# EAGLE design WILD64_HDI (EAGLE 9.6.2)
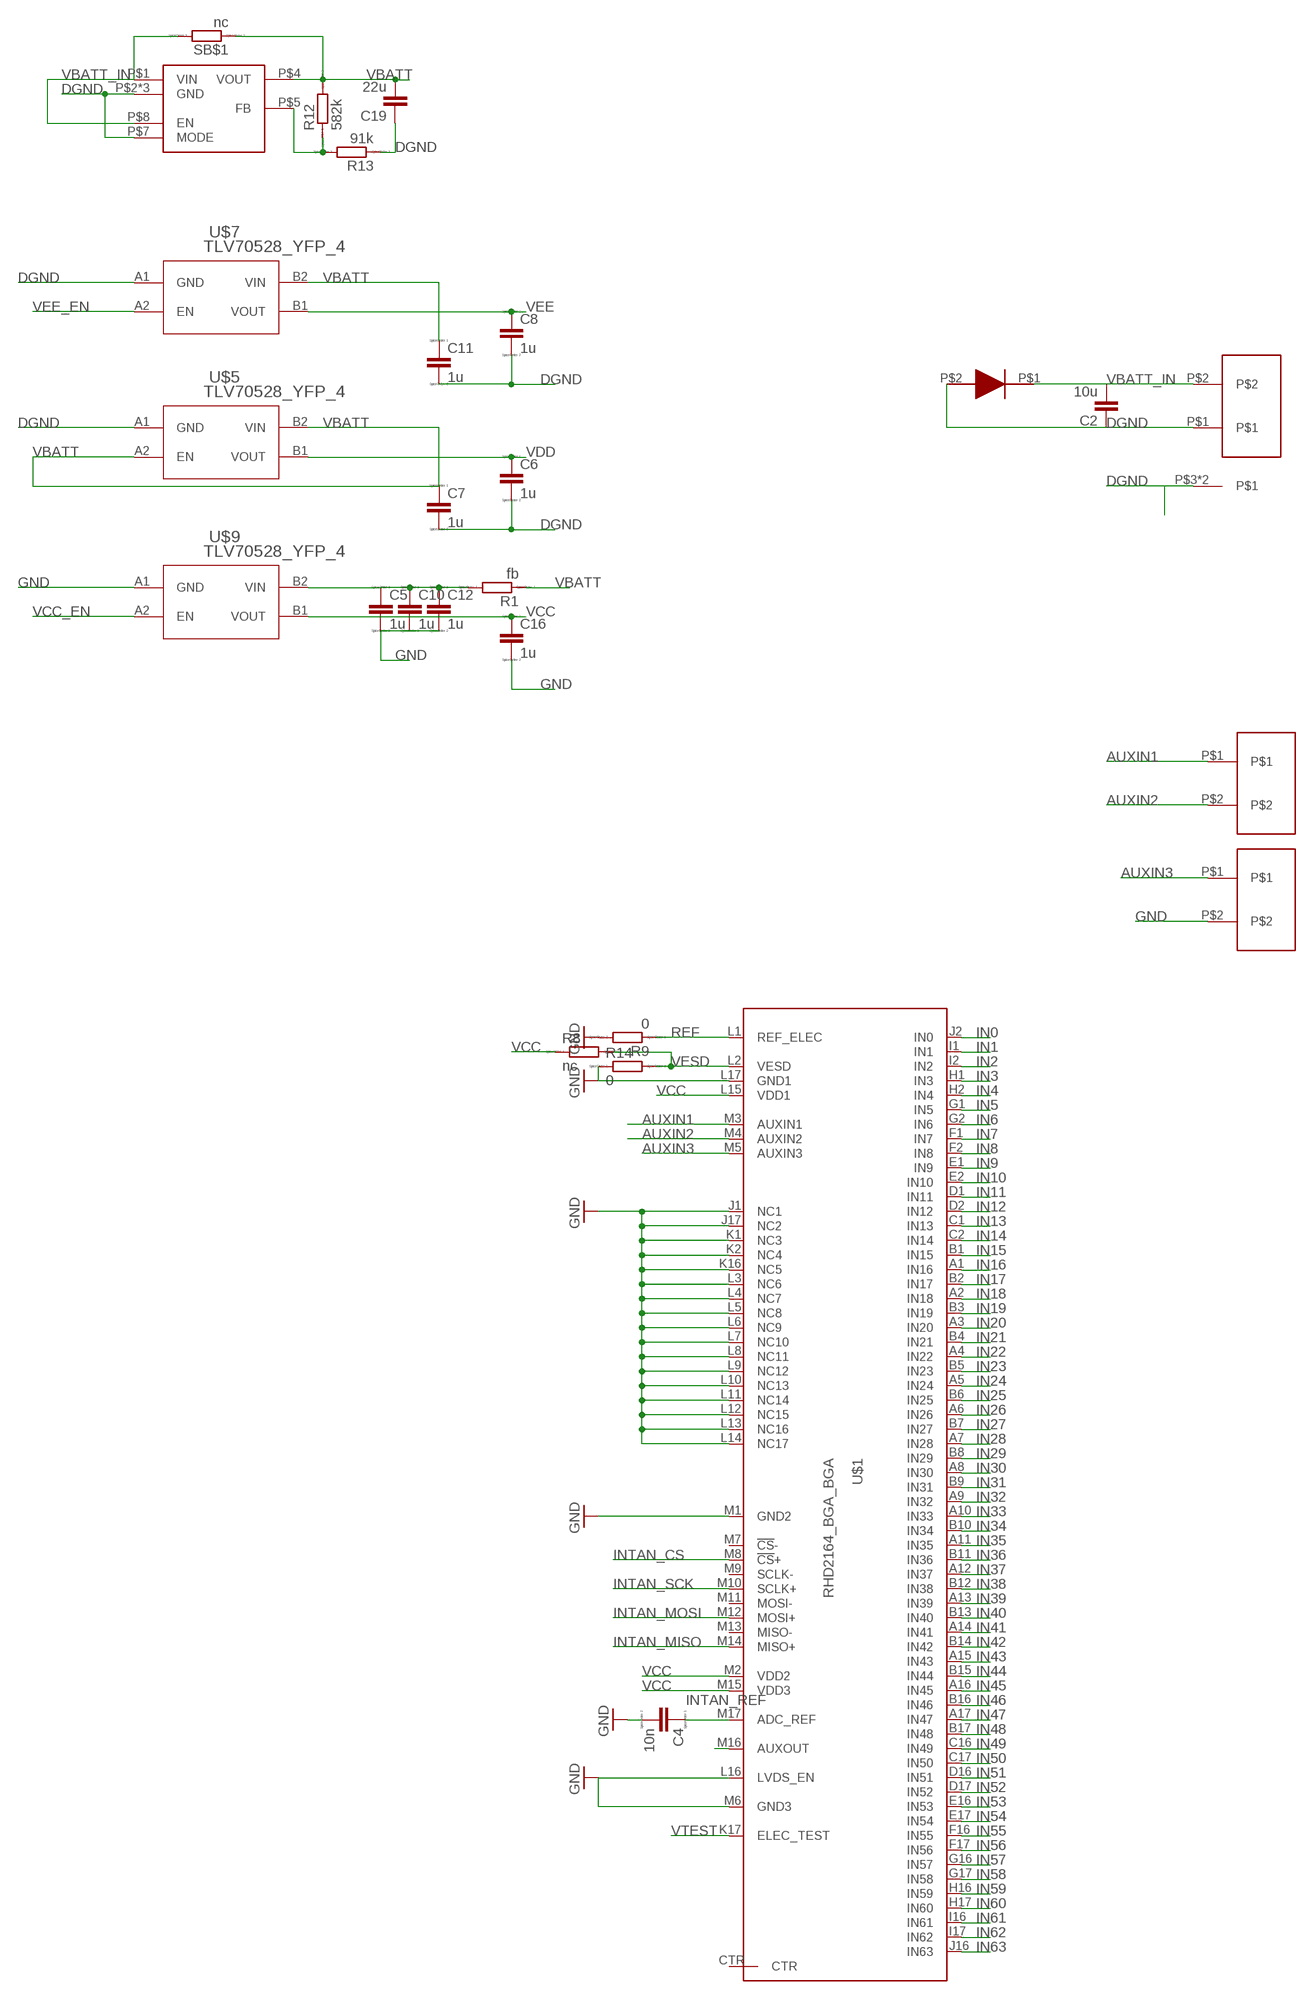
[diagram p0: schematic, sheet 1, part 1 of 2]
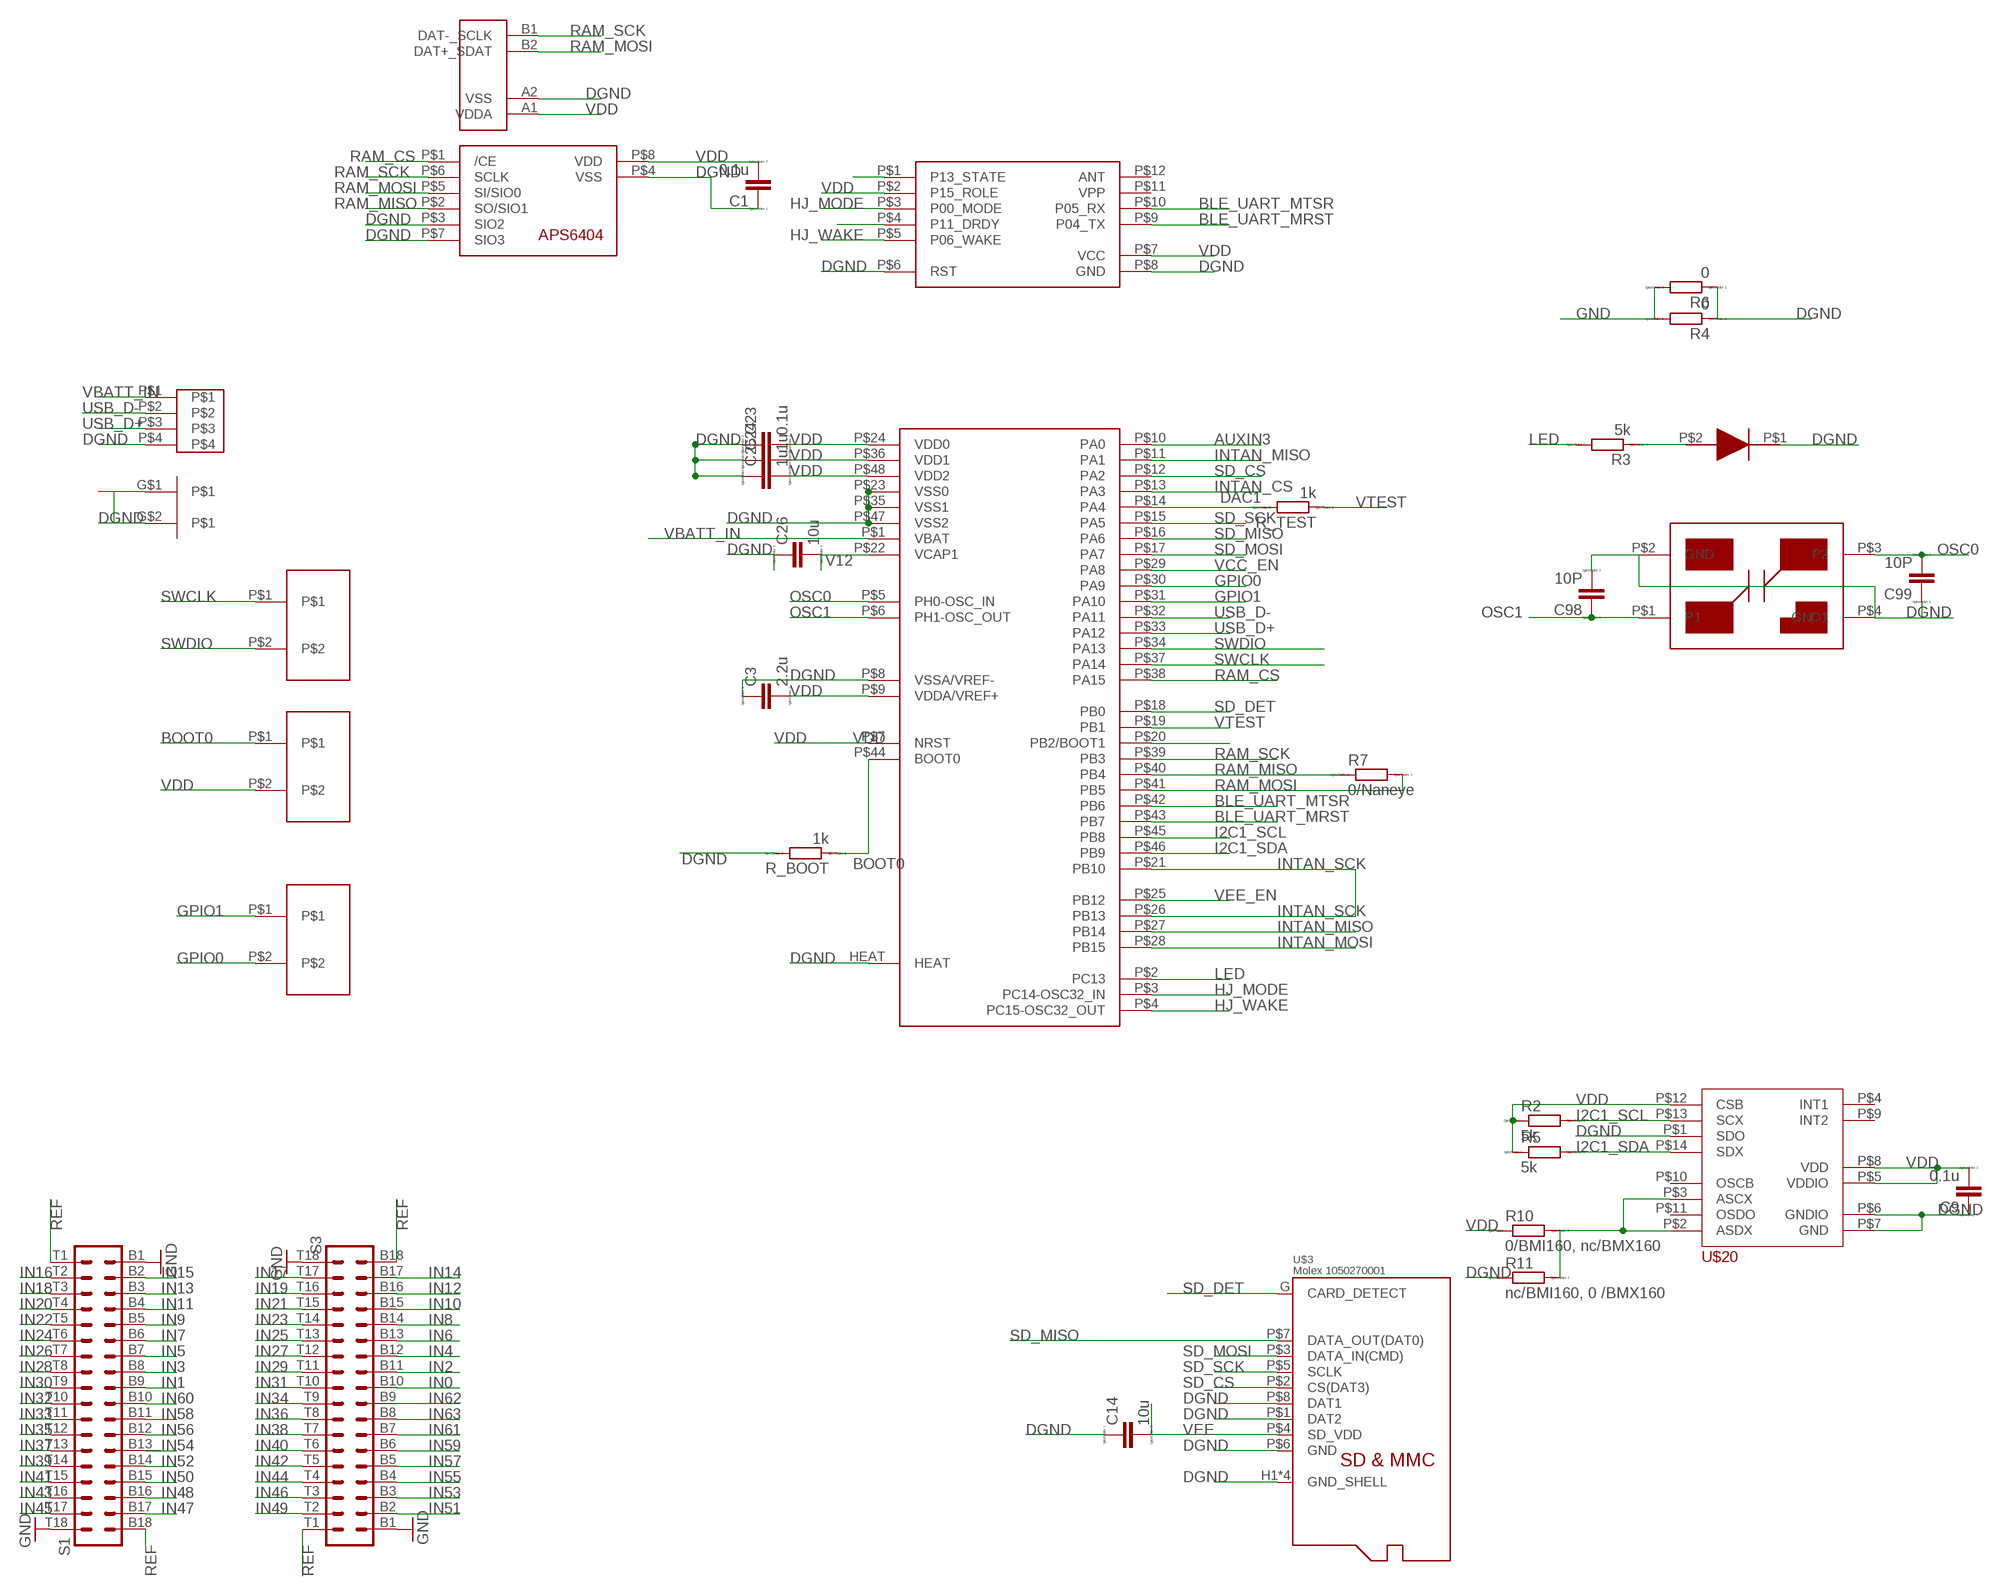
[diagram p1: schematic, sheet 1, part 2 of 2]

## Parts
C1  0.1u  CC0201  [C0201]
C2  10u  C_0402  [0402]
C3  2.2u  CC0201  [C0201]
C4  10n  CC0201  [C0201]
C5  1u  CC0201  [C0201]
C6  1u  CC0201  [C0201]
C7  1u  CC0201  [C0201]
C8  1u  CC0201  [C0201]
C9  0.1u  CC0201  [C0201]
C10  1u  CC0201  [C0201]
C11  1u  CC0201  [C0201]
C12  1u  CC0201  [C0201]
C14  10u  CC0402  [C0402]
C16  1u  CC0201  [C0201]
C19  22u  C_0402  [0402]
C23  0.1u  CC0201  [C0201]
C24  1u  CC0201  [C0201]
C25  1u  CC0201  [C0201]
C26  10u  CC0402  [C0402]
C98  10P  CC0201  [C0201]
C99  10P  CC0201  [C0201]
R1  fb  RR0201  [R0201]
R2  5k  RR0201  [R0201]
R3  5k  RR0201  [R0201]
R4  0  RR0201  [R0201]
R5  5k  RR0201  [R0201]
R6  0  RR0201  [R0201]
R7  0/Naneye  RR0201  [R0201]
R8  nc  RR0201  [R0201]
R9  0  RR0402  [R0402]
R10  0/BMI160, nc/BMX160  RR0201  [R0201]
R11  nc/BMI160, 0 /BMX160  RR0201  [R0201]
R12  582k  RR0201  [R0201]
R13  91k  RR0201  [R0201]
R14  0  RR0201  [R0201]
R_BOOT  1k  RR0201  [R0201]
R_TEST  1k  RR0201  [R0201]
S1  OMNETICS_A79025  [OMNETICS_A79025]
S3  OMNETICS_A79025  [OMNETICS_A79025]
SB$1  nc  RR0201  [R0201]
U$1  RHD2164_BGA_BGA  [BGA104_9X7]
U$2  1.0MM_1X2VIA  [PIN_1.0MM_1X2]
U$3  Molex 1050270001  MICROSD_SHORT_1.7H  [MICROSD_SHORT_1.7H]
U$4  NANEYECBGA  [NANEYEC_4BGA]
U$5  TLV70528_YFP_4  [YFP4]
U$6  STM32F411_QFN48  [UFQFPN48]
U$7  TLV70528_YFP_4  [YFP4]
U$8  1.27MM_1X2CONN  [1.27MM_1X2]
U$9  TLV70528_YFP_4  [YFP4]
U$10  HJ580  [HJ580]
U$11  DIODE0402  [0402_LED]
U$12  1.0MM_1X4PAD  [1.0MM_CONN_1X4_SMD]
U$13  1.00MM_1X2PAD  [1.0MM_CONN_1X2_SMD]
U$14  APS6404  [USON-8L_3X2]
U$15  ABM12_CRYSTAL  [SMD4_1.6MMX1.2MM]
U$16  DIODE0402  [0402_LED]
U$17  1.27MM_1X2CONN  [1.27MM_1X2]
U$18  1.27MM_1X2CONN  [1.27MM_1X2]
U$19  1.27MM_1X2CONN  [1.27MM_1X2]
U$20  BMI27014  [14_VFLGA]
U$22  TPSM83100  [MICROSIP_SIU0008A]

## Nets
AUXIN1: U$1.M3(AUXIN1) U$19.P$1
AUXIN2: U$1.M4(AUXIN2) U$19.P$2
AUXIN3: U$1.M5(AUXIN3) U$6.P$10(PA0) U$18.P$1
AUXOUT: U$1.M16(AUXOUT)
BLE_UART_MRST: U$6.P$43(PB7) U$10.P$9(P04_TX)
BLE_UART_MTSR: U$6.P$42(PB6) U$10.P$10(P05_RX)
BOOT0: R_BOOT.1 U$6.P$44(BOOT0) U$8.P$1
DAC1: R_TEST.2 U$6.P$14(PA4)
DGND: C1.1 C2.1 C3.1 C6.2 C7.2 C8.2 C9.1 C11.2 C14.1 C19.1 C23.1 C24.1 C25.1 C26.1 C98.2 C99.1 R4.1 R6.1 R11.1 R13.1 R_BOOT.2 U$3.H1(GND_SHELL) U$3.H2(GND_SHELL) U$3.H3(GND_SHELL) U$3.H4(GND_SHELL) U$3.P$1(DAT2) U$3.P$6(GND) U$3.P$8(DAT1) U$4.A2(VSS) U$5.A1(GND) U$6.HEAT U$6.P$8(VSSA/VREF-) U$6.P$23(VSS0) U$6.P$35(VSS1) U$6.P$47(VSS2) U$7.A1(GND) U$10.P$6(RST) U$10.P$8(GND) U$11.P$2(IN) U$12.G$1 U$12.G$2 U$12.P$4 U$13.P$1 U$13.P$3 U$13.P$4 U$14.P$3(SIO2) U$14.P$4(VSS) U$14.P$7(SIO3) U$15.P$2(GND) U$15.P$4(GND1) U$16.P$1(OUT) U$20.P$1(SDO) U$20.P$6(GNDIO) U$20.P$7(GND) U$22.P$2(GND) U$22.P$3(GND) U$22.P$6(GND) U$22.P$7(MODE)
GND [thick]: C4.2 C5.2 C10.2 C12.2 C16.2 R4.2 R6.2 R9.2 R14.1 S1.B1 S1.T18 S3.B1 S3.T18 U$1.J1(NC1) U$1.J17(NC2) U$1.K1(NC3) U$1.K2(NC4) U$1.K16(NC5) U$1.L3(NC6) U$1.L4(NC7) U$1.L5(NC8) U$1.L6(NC9) U$1.L7(NC10) U$1.L8(NC11) U$1.L9(NC12) U$1.L10(NC13) U$1.L11(NC14) U$1.L12(NC15) U$1.L13(NC16) U$1.L14(NC17) U$1.L16(LVDS_EN) U$1.L17(GND1) U$1.M1(GND2) U$1.M6(GND3) U$9.A1(GND) U$18.P$2
GPIO0: U$6.P$30(PA9) U$17.P$2
GPIO1: U$6.P$31(PA10) U$17.P$1
HJ_MODE: U$6.P$3(PC14-OSC32_IN) U$10.P$3(P00_MODE)
HJ_WAKE: U$6.P$4(PC15-OSC32_OUT) U$10.P$5(P06_WAKE)
I2C1_SCL: R2.2 U$6.P$45(PB8) U$20.P$13(SCX)
I2C1_SDA: R5.2 U$6.P$46(PB9) U$20.P$14(SDX)
IN0: S3.B10 U$1.J2(IN0)
IN1: S1.B9 U$1.I1(IN1)
IN2: S3.B11 U$1.I2(IN2)
IN3: S1.B8 U$1.H1(IN3)
IN4: S3.B12 U$1.H2(IN4)
IN5: S1.B7 U$1.G1(IN5)
IN6: S3.B13 U$1.G2(IN6)
IN7: S1.B6 U$1.F1(IN7)
IN8: S3.B14 U$1.F2(IN8)
IN9: S1.B5 U$1.E1(IN9)
IN10: S3.B15 U$1.E2(IN10)
IN11: S1.B4 U$1.D1(IN11)
IN12: S3.B16 U$1.D2(IN12)
IN13: S1.B3 U$1.C1(IN13)
IN14: S3.B17 U$1.C2(IN14)
IN15: S1.B2 U$1.B1(IN15)
IN16: S1.T2 U$1.A1(IN16)
IN17: S3.T17 U$1.B2(IN17)
IN18: S1.T3 U$1.A2(IN18)
IN19: S3.T16 U$1.B3(IN19)
IN20: S1.T4 U$1.A3(IN20)
IN21: S3.T15 U$1.B4(IN21)
IN22: S1.T5 U$1.A4(IN22)
IN23: S3.T14 U$1.B5(IN23)
IN24: S1.T6 U$1.A5(IN24)
IN25: S3.T13 U$1.B6(IN25)
IN26: S1.T7 U$1.A6(IN26)
IN27: S3.T12 U$1.B7(IN27)
IN28: S1.T8 U$1.A7(IN28)
IN29: S3.T11 U$1.B8(IN29)
IN30: S1.T9 U$1.A8(IN30)
IN31: S3.T10 U$1.B9(IN31)
IN32: S1.T10 U$1.A9(IN32)
IN33: S1.T11 U$1.A10(IN33)
IN34: S3.T9 U$1.B10(IN34)
IN35: S1.T12 U$1.A11(IN35)
IN36: S3.T8 U$1.B11(IN36)
IN37: S1.T13 U$1.A12(IN37)
IN38: S3.T7 U$1.B12(IN38)
IN39: S1.T14 U$1.A13(IN39)
IN40: S3.T6 U$1.B13(IN40)
IN41: S1.T15 U$1.A14(IN41)
IN42: S3.T5 U$1.B14(IN42)
IN43: S1.T16 U$1.A15(IN43)
IN44: S3.T4 U$1.B15(IN44)
IN45: S1.T17 U$1.A16(IN45)
IN46: S3.T3 U$1.B16(IN46)
IN47: S1.B17 U$1.A17(IN47)
IN48: S1.B16 U$1.B17(IN48)
IN49: S3.T2 U$1.C16(IN49)
IN50: S1.B15 U$1.C17(IN50)
IN51: S3.B2 U$1.D16(IN51)
IN52: S1.B14 U$1.D17(IN52)
IN53: S3.B3 U$1.E16(IN53)
IN54: S1.B13 U$1.E17(IN54)
IN55: S3.B4 U$1.F16(IN55)
IN56: S1.B12 U$1.F17(IN56)
IN57: S3.B5 U$1.G16(IN57)
IN58: S1.B11 U$1.G17(IN58)
IN59: S3.B6 U$1.H16(IN59)
IN60: S1.B10 U$1.H17(IN60)
IN61: S3.B7 U$1.I16(IN61)
IN62: S3.B9 U$1.I17(IN62)
IN63: S3.B8 U$1.J16(IN63)
INTAN_CS: U$1.M8(!CS!+) U$6.P$13(PA3)
INTAN_MISO: U$1.M14(MISO+) U$6.P$11(PA1) U$6.P$27(PB14)
INTAN_MOSI: U$1.M12(MOSI+) U$6.P$28(PB15)
INTAN_REF: C4.1 U$1.M17(ADC_REF)
INTAN_SCK: U$1.M10(SCLK+) U$6.P$21(PB10) U$6.P$26(PB13)
LED: R3.2 U$6.P$2(PC13)
N$1: R10.2 R11.2 U$20.P$2(ASDX) U$20.P$3(ASCX)
N$7: R12.1 R13.2 U$22.P$5(FB)
N$11: R3.1 U$16.P$2(IN)
N$16: U$10.P$4(P11_DRDY)
N$21: U$10.P$1(P13_STATE)
N$27: U$6.P$20(PB2/BOOT1)
OSC0: C99.2 U$6.P$5(PH0-OSC_IN) U$15.P$3(P2)
OSC1: C98.1 U$6.P$6(PH1-OSC_OUT) U$15.P$1(P1)
RAM_CS: U$6.P$38(PA15) U$14.P$1(/CE)
RAM_MISO: R7.1 U$6.P$40(PB4) U$14.P$2(SO/SIO1)
RAM_MOSI: R7.2 U$4.B2(DAT+_SDAT) U$6.P$41(PB5) U$14.P$5(SI/SIO0)
RAM_SCK: U$4.B1(DAT-_SCLK) U$6.P$39(PB3) U$14.P$6(SCLK)
REF [thick]: R9.1 S1.B18 S1.T1 S3.B18 S3.T1 U$1.L1(REF_ELEC)
SD_CS: U$3.P$2(CS(DAT3)) U$6.P$12(PA2)
SD_DET: U$3.G(CARD_DETECT) U$6.P$18(PB0)
SD_MISO: U$3.P$7(DATA_OUT(DAT0)) U$6.P$16(PA6)
SD_MOSI: U$3.P$3(DATA_IN(CMD)) U$6.P$17(PA7)
SD_SCK: U$3.P$5(SCLK) U$6.P$15(PA5)
SWCLK: U$2.P$1 U$6.P$37(PA14)
SWDIO: U$2.P$2 U$6.P$34(PA13)
USB_D+: U$6.P$33(PA12) U$12.P$3
USB_D-: U$6.P$32(PA11) U$12.P$2
V12: C26.2 U$6.P$22(VCAP1)
VBATT: C7.1 C11.1 C19.2 R1.1 R12.2 SB$1.1 U$5.A2(EN) U$5.B2(VIN) U$7.B2(VIN) U$22.P$4(VOUT)
VBATT_IN: C2.2 SB$1.2 U$6.P$1(VBAT) U$11.P$1(OUT) U$12.P$1 U$13.P$2 U$22.P$1(VIN) U$22.P$8(EN)
VCC: C16.1 R8.1 U$1.L15(VDD1) U$1.M2(VDD2) U$1.M15(VDD3) U$9.B1(VOUT)
VCC_EN: U$6.P$29(PA8) U$9.A2(EN)
VCC_LPF: C5.1 C10.1 C12.1 R1.2 U$9.B2(VIN)
VDD: C1.2 C3.2 C6.1 C9.2 C23.2 C24.2 C25.2 R2.1 R5.1 R10.1 U$4.A1(VDDA) U$5.B1(VOUT) U$6.P$7(NRST) U$6.P$9(VDDA/VREF+) U$6.P$24(VDD0) U$6.P$36(VDD1) U$6.P$48(VDD2) U$8.P$2 U$10.P$2(P15_ROLE) U$10.P$7(VCC) U$14.P$8(VDD) U$20.P$5(VDDIO) U$20.P$8(VDD) U$20.P$12(CSB)
VEE: C8.1 C14.2 U$3.P$4(SD_VDD) U$7.B1(VOUT)
VEE_EN: U$6.P$25(PB12) U$7.A2(EN)
VESD [thick]: R8.2 R14.2 U$1.L2(VESD)
VTEST: R_TEST.1 U$1.K17(ELEC_TEST) U$6.P$19(PB1)
Unconnected: U$1.CTR U$1.M7(!CS!-) U$1.M9(SCLK-) U$1.M11(MOSI-) U$1.M13(MISO-) U$10.P$11(VPP) U$10.P$12(ANT) U$20.P$4(INT1) U$20.P$9(INT2) U$20.P$10(OSCB) U$20.P$11(OSDO)

## Library data of the parts
C1 C3-C12 C14 C16 C23-C26 C98 C99 = eagle-ltspice:C: CAPACITOR, European symbol; SPICEMODEL: NONE; SPICEPREFIX: C
C2 C19 = INTAN_largeBGA:C: Capacitor
R1-R14 R_BOOT R_TEST SB$1 = eagle-ltspice:R: RESISTOR, European symbol; SPICEMODEL: NONE; SPICEPREFIX: R
S1 S3 = intan:OMNETICS_A79025: Omnetics A79025 36-pin connector
U$1 = INTAN_largeBGA:RHD2164_BGA: Intan Technologies RHD2164 chip, BGA package (9x7mm 104-pin)
U$2 = HD128:1.0MM_1X2VIA
U$3 = HD128:MICROSD_SHORT_1.7H
U$4 = HD128:NANEYEC
U$5 U$7 U$9 = TLV7025:TLV70528_YFP_4; DATASHEETURL: http://www.ti.com/lit/gpn/TLV70528; DESCRIPTION: 200-mA, Low IQ, Low-Noise, Low-Dropout Regulator in Ultra-Small 0.8-mm x 0.8-mm WCSP; FAMILY_NAME: SINGLE CHANNEL LDO; GENERIC_PART_NUMBER: TLV70528; INDUSTRY_STD_PKG_TYPE: DSBGA; MANUFACTURER: Texas Instruments; MANUFACTURER_PART_NUMBER: tlv70528_yfp_4; PACKAGE_DESIGNATOR: YFP; PIN_COUNT: 4; VENDOR: Texas Instruments
U$6 = HD128:STM32F411_QFN48
U$8 U$17-U$19 = HD128:1.27MM_1X2CONN
U$10 = HD128:HJ580
U$11 U$16 = HD128:DIODE
U$12 = HD128:1.0MM_1X4PAD
U$13 = HD128:1.00MM_1X2PAD
U$14 = HD128:APS6404
U$15 = HD128:ABM12_CRYSTAL
U$20 = HD128:BMI270
U$22 = HD128:TPSM83100

## Net classes
1 thick: width 0.102 mm

## Board
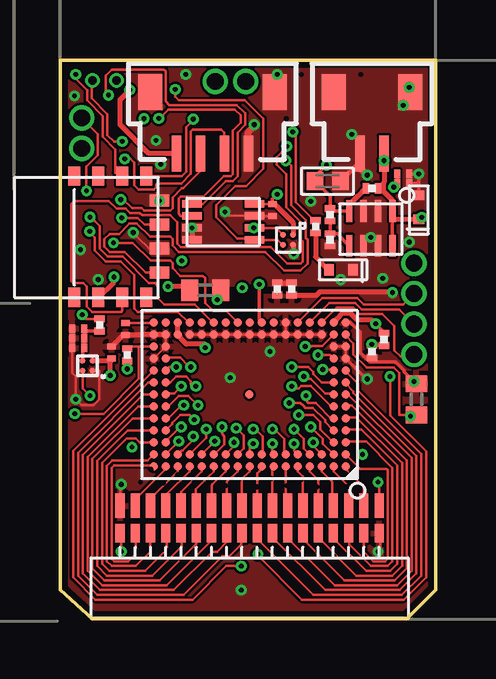
[diagram p2: board, top side]
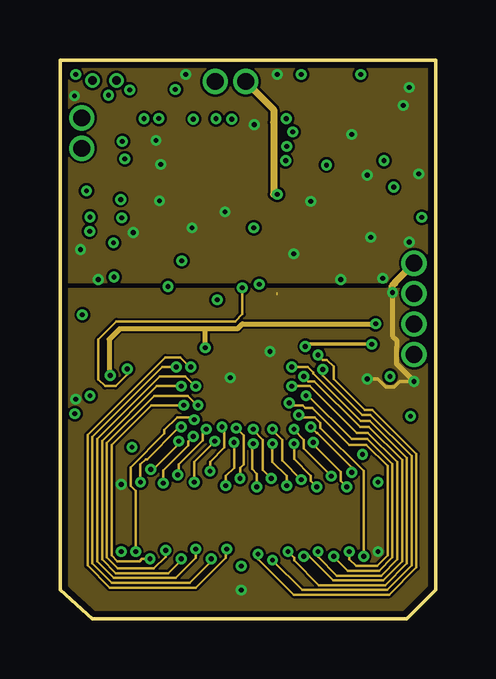
[diagram p3: board, inner layer Route2]
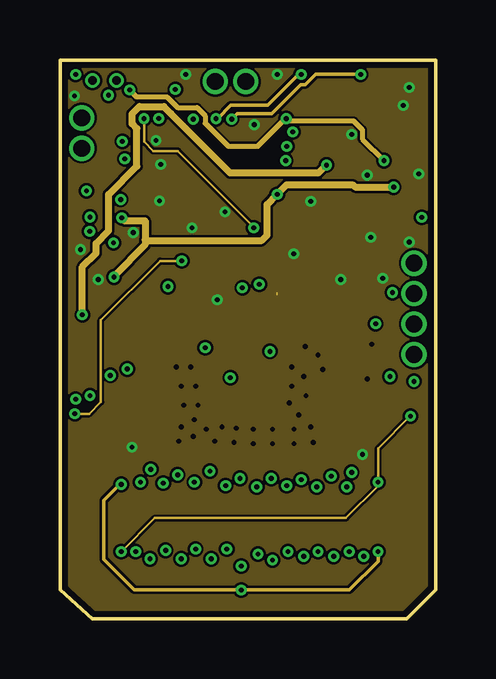
[diagram p4: board, inner layer Route15]
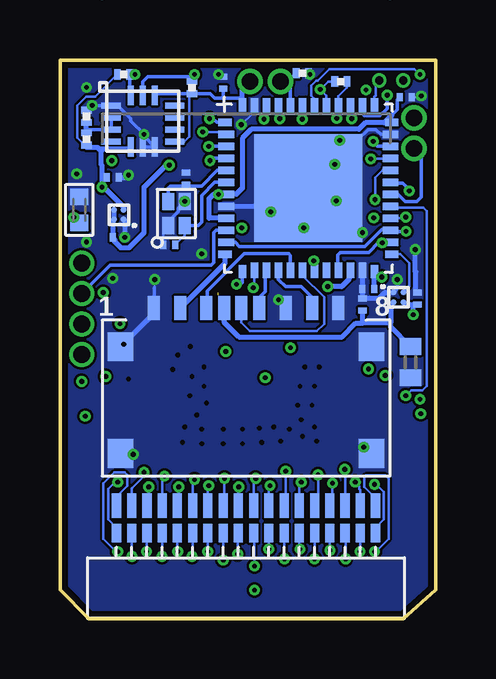
[diagram p5: board, bottom side, seen from below]

Size 15.65 x 23.3 mm. Coordinates in mm from the lower left corner, seen from the top.
Outline: 15.65,1.2 15.65,23.3 0,23.3 0,1.2 1.35,0 14.45,0 15.65,1.2
Copper layers ([2:[1+2*15+16:2]]): Top 0.012mm / dielectric 0.3mm / Route2 0.018mm / dielectric 0.34mm / Route15 0.018mm / dielectric 0.3mm / Bottom 0.012mm
Design rules "HQPCB_4layers_0.2mm_4mil *": minimum track width 0.1mm, minimum drill 0.2mm, track to track 0.1mm, track to pad 0.1mm, pad to pad 0.1mm, via to via 0.1mm, smd to smd 0mil, copper to edge 0.25mm, drill to drill 0.35mm, minimum pad ring 0.125mm, minimum via ring 0.125mm, stop-mask expansion 0mil, vias tented up to drill 0.3mm, thermal gap 0.2mm

### Footprints (pad centres in the part's own frame; a part is rotated, then mirrored left to right if it is on the bottom)
C0201 = smd 0.25 x 0.35: 1 -0.25,0; 2 0.25,0
0402 = smd 0.686 x 0.762: 1 -0.533,0; 2 0.533,0
C0402 = smd 0.7 x 0.9: 1 -0.65,0; 2 0.65,0
R0201 = smd 0.28 x 0.43: 1 -0.255,0; 2 0.255,0
R0402 = smd 0.7 x 0.9: 1 -0.65,0; 2 0.65,0
OMNETICS_A79025 = smd 0.381 x 0.762: B1 -5.397,-1.016; B2 -4.763,-1.016; B3 -4.128,-1.016; B4 -3.493,-1.016; B5 -2.857,-1.016; B6 -2.223,-1.016; B7 -1.587,-1.016; B8 -0.953,-1.016; B9 -0.318,-1.016; B10 0.318,-1.016; B11 0.953,-1.016; B12 1.587,-1.016; B13 2.223,-1.016; B14 2.857,-1.016; B15 3.493,-1.016; B16 4.128,-1.016; B17 4.763,-1.016; B18 5.397,-1.016 | smd 0.381 x 1.016: T1 -5.397,-2.159; T2 -4.763,-2.159; T3 -4.128,-2.159; T4 -3.493,-2.159; T5 -2.857,-2.159; T6 -2.223,-2.159; T7 -1.587,-2.159; T8 -0.953,-2.159; T9 -0.318,-2.159; T10 0.318,-2.159; T11 0.953,-2.159; T12 1.587,-2.159; T13 2.223,-2.159; T14 2.857,-2.159; T15 3.493,-2.159; T16 4.128,-2.159; T17 4.763,-2.159; T18 5.397,-2.159
BGA104_9X7 = smd 0.35 x 0.35: A1 -4,3; A2 -3.5,3; A3 -3,3; A4 -2.5,3; A5 -2,3; A6 -1.5,3; A7 -1,3; A8 -0.5,3; A9 0,3; A10 0.5,3; A11 1,3; A12 1.5,3; A13 2,3; A14 2.5,3; A15 3,3; A16 3.5,3; A17 4,3; B1 -4,2.5; B2 -3.5,2.5; B3 -3,2.5; B4 -2.5,2.5; B5 -2,2.5; B6 -1.5,2.5; B7 -1,2.5; B8 -0.5,2.5; B9 0,2.5; B10 0.5,2.5; B11 1,2.5; B12 1.5,2.5; B13 2,2.5; B14 2.5,2.5; B15 3,2.5; B16 3.5,2.5; B17 4,2.5; C1 -4,2; C2 -3.5,2; C16 3.5,2; C17 4,2; CTR 0.01,0; D1 -4,1.5; D2 -3.5,1.5; D16 3.5,1.5; D17 4,1.5; E1 -4,1; E2 -3.5,1; E16 3.5,1; E17 4,1; F1 -4,0.5; F2 -3.5,0.5; F16 3.5,0.5; F17 4,0.5; G1 -4,0; G2 -3.5,0; G16 3.5,0; G17 4,0; H1 -4,-0.5; H2 -3.5,-0.5; H16 3.5,-0.5; H17 4,-0.5; I1 -4,-1; I2 -3.5,-1; I16 3.5,-1; I17 4,-1; J1 -4,-1.5; J2 -3.5,-1.5; J16 3.5,-1.5; J17 4,-1.5; K1 -4,-2; K2 -3.5,-2; K16 3.5,-2; K17 4,-2; L1 -4,-2.5; L2 -3.5,-2.5; L3 -3,-2.5; L4 -2.5,-2.5; L5 -2,-2.5; L6 -1.5,-2.5; L7 -1,-2.5; L8 -0.5,-2.5; L9 0,-2.5; L10 0.5,-2.5; L11 1,-2.5; L12 1.5,-2.5; L13 2,-2.5; L14 2.5,-2.5; L15 3,-2.5; L16 3.5,-2.5; L17 4,-2.5; M1 -4,-3; M2 -3.5,-3; M3 -3,-3; M4 -2.5,-3; M5 -2,-3; M6 -1.5,-3; M7 -1,-3; M8 -0.5,-3; M9 0,-3; M10 0.5,-3; M11 1,-3; M12 1.5,-3; M13 2,-3; M14 2.5,-3; M15 3,-3; M16 3.5,-3; M17 4,-3
PIN_1.0MM_1X2 = drill 0.35: P$1 -0.5,0; P$2 0.5,0
MICROSD_SHORT_1.7H = smd 0.5 x 1: G 0.2,0.5; P$1 3.85,0.5; P$2 2.75,0.5; P$3 1.65,0.5; P$4 0.9,0.5; P$5 -0.55,0.5; P$6 -1.65,0.5; P$7 -2.75,0.5; P$8 -3.85,0.5 | smd 1.05 x 1.2: H1 -5.23,6.56; H2 -5.23,2.11; H3 5.23,6.56; H4 5.23,2.11
NANEYEC_4BGA = smd 0.25 x 0.25: A1 -0.215,0.215; A2 0.21,0.215; B1 -0.215,-0.21; B2 0.21,-0.21
YFP4 = smd 0.25 x 0.25: A1 -0.203,0.203; A2 0.203,0.203; B1 -0.203,-0.203; B2 0.203,-0.203
UFQFPN48 = smd 4.5 x 4.5: HEAT 0,0 | smd 0.55 x 0.3: P$1 -3.475,2.75; P$12 -3.475,-2.75; P$25 3.475,-2.75; P$36 3.475,2.75 | smd 0.65 x 0.3: P$2 -3.425,2.25; P$3 -3.425,1.75; P$4 -3.425,1.25; P$5 -3.425,0.75; P$6 -3.425,0.25; P$7 -3.425,-0.25; P$8 -3.425,-0.75; P$9 -3.425,-1.25; P$10 -3.425,-1.75; P$11 -3.425,-2.25; P$26 3.425,-2.25; P$27 3.425,-1.75; P$28 3.425,-1.25; P$29 3.425,-0.75; P$30 3.425,-0.25; P$31 3.425,0.25; P$32 3.425,0.75; P$33 3.425,1.25; P$34 3.425,1.75; P$35 3.425,2.25 | smd 0.3 x 0.55: P$13 -2.75,-3.475; P$24 2.75,-3.475; P$37 2.75,3.475; P$48 -2.75,3.475 | smd 0.3 x 0.65: P$14 -2.25,-3.425; P$15 -1.75,-3.425; P$16 -1.25,-3.425; P$17 -0.75,-3.425; P$18 -0.25,-3.425; P$19 0.25,-3.425; P$20 0.75,-3.425; P$21 1.25,-3.425; P$22 1.75,-3.425; P$23 2.25,-3.425; P$38 2.25,3.425; P$39 1.75,3.425; P$40 1.25,3.425; P$41 0.75,3.425; P$42 0.25,3.425; P$43 -0.25,3.425; P$44 -0.75,3.425; P$45 -1.25,3.425; P$46 -1.75,3.425; P$47 -2.25,3.425
1.27MM_1X2 = drill 0.7 pad 1: P$1 -0.635,0; P$2 0.635,0
HJ580 = smd 0.8 x 0.5: P$1 -2.5,1.5; P$2 -2.5,0.5; P$3 -2.5,-0.5; P$4 -2.5,-1.5; P$9 2.552,-1.5; P$10 2.552,-0.5; P$11 2.552,0.5; P$12 2.552,1.5 | smd 0.5 x 0.8: P$5 -1.472,-2.042; P$6 -0.472,-2.042; P$7 0.528,-2.042; P$8 1.528,-2.042
0402_LED = smd 0.4 x 0.46: P$1 -0.5,0; P$2 0.5,0
1.0MM_CONN_1X4_SMD = smd 1 x 1.5: G$1 2.6,-1.81; G$2 -2.6,-1.81 | smd 0.4 x 1.5: P$1 1.5,0.75; P$2 0.5,0.75; P$3 -0.5,0.75; P$4 -1.5,0.75
1.0MM_CONN_1X2_SMD = smd 0.4 x 1.5: P$1 0.5,0.75; P$2 -0.5,0.75 | smd 1 x 1.5: P$3 1.6,-1.81; P$4 -1.6,-1.81
USON-8L_3X2 = smd 0.8 x 0.3: P$1 -1.3,0.75; P$2 -1.3,0.25; P$3 -1.3,-0.25; P$4 -1.3,-0.75; P$5 1.3,-0.75; P$6 1.3,-0.25; P$7 1.3,0.25; P$8 1.3,0.75
SMD4_1.6MMX1.2MM = smd 0.7 x 0.5: P$1 -0.5,-0.35; P$2 0.5,-0.35; P$3 0.5,0.35; P$4 -0.5,0.35
14_VFLGA = smd 0.8 x 0.25: P$1 -1.325,0.65; P$2 -1.325,0.15; P$3 -1.325,-0.35; P$4 -1.325,-0.85; P$8 1.325,-0.85; P$9 1.325,-0.35; P$10 1.325,0.15; P$11 1.325,0.65 | smd 0.25 x 0.8: P$5 -0.5,-1.075; P$6 0,-1.075; P$7 0.5,-1.075; P$12 0.5,1.075; P$13 0,1.075; P$14 -0.5,1.075
MICROSIP_SIU0008A = smd 0.9 x 0.26: P$1 -0.75,0.9; P$2 -0.75,0.3; P$3 -0.75,-0.3; P$4 -0.75,-0.9; P$5 0.7,-0.9; P$6 0.7,-0.3; P$7 0.7,0.3; P$8 0.7,0.9

### Placement (x,y rotation side)
C1  8.85,17.05 90 top
C2  14.85,17.05 270 bottom
C3  14.3,18.55 180 top
C4  2.73,12.09 270 top
C5  0.75,11.7 180 top
C6  13.45,18.4 0 bottom
C7  13.2,15.9 0 bottom
C8  3.05,13.1 90 bottom
C9  14.3,18.15 180 top
C10  0.75,12.1 180 top
C11  0.75,13.35 90 bottom
C12  0.75,11.3 180 top
C14  1.05,10.7 90 bottom
C16  2.15,11.1 90 top
C19  11.15,18.25 180 top
C23  2.8,13.75 0 bottom
C24  1.25,21.75 180 bottom
C25  8.85,22.35 270 bottom
C26  6.05,13.7 180 top
C98  11.1,15.6 180 bottom
C99  10.4,18.35 270 bottom
R1  1.65,12.25 270 top
R2  10.15,22.15 90 bottom
R3  10.65,16.35 90 top
R4  9.05,13.75 270 top
R5  13,22.7 0 bottom
R6  9.65,13.75 270 top
R7  3.95,22.4 180 bottom
R8  13.5,11.65 270 top
R9  14.85,9.15 90 top
R10  14.55,20 90 bottom
R11  14.55,20.95 270 bottom
R12  11.25,16.85 90 top
R13  11.25,15.8 90 top
R14  13,11.15 90 top
R_BOOT  5.55,22.75 0 bottom
R_TEST  2.8,11 270 top
S1  7.9,2.55 180 top
S3  7.9,2.55 180 bottom
SB$1  13,17.95 0 top
U$1  7.9,9.35 180 top
U$2  1.85,22.45 0 bottom
U$3  7.9,13.45 180 bottom
U$4  9.5,15.8 270 top
U$5  13.2,16.85 180 bottom
U$6  5.3,17.95 0 bottom
U$7  1.55,13.4 0 bottom
U$8  7.1,22.4 180 bottom
U$9  1.15,10.55 180 top
U$10  2.1,15.9 90 top
U$11  14.95,17.15 90 top
U$12  6.35,20.15 180 top
U$13  13,20.15 180 top
U$14  6.8,16.55 0 top
U$15  10.8,16.9 90 bottom
U$16  11.7,14.55 180 top
U$17  0.9,20.25 270 top
U$18  14.75,14.19 90 top
U$19  14.75,11.65 90 top
U$20  12.2,20.75 0 bottom
U$22  12.95,16.25 270 top

### Tracks (layer width: path | path; a pad name or v marks a point on that pad's centre or on a via)
AUXIN1
  Top 0.1: 13.92,12.21 13.43,12.7 12.49,12.7 12.22,12.98 11.53,12.98 U$1.M3 | U$19.P$1 14.66,10.93 14.62,10.93
  Top 0.102: 13.92,12.21 13.92,11.19 14.19,10.93 14.62,10.93
AUXIN2
  Top 0.1: U$19.P$2 14.13,12.9 12.57,12.9 12.3,13.18 11.22,13.18 U$1.M4
AUXIN3
  Top 0.1: U$1.M5 10.92,13.38 12.38,13.38 12.65,13.11 14.3,13.11 U$18.P$1
  Bottom 0.152: U$6.P$10 9.15,16.2 9.25,16.1 9.25,14.85 9.35,14.75 13.55,14.75 U$18.P$1
BLE_UART_MRST  (via drill 0.2)
  Top 0.1: v5.55,20.84 5.55,20.8 5.25,20.5 5.25,18.64 5.06,18.45 U$10.P$9
  Bottom 0.1: U$6.P$43 v5.55,20.84
BLE_UART_MTSR  (via drill 0.2)
  Top 0.1: v0.65,22.7 0.65,22.6 0.65,22.51 1.12,22.04 1.12,21.62 1.77,20.96 1.77,20.09 2.3,19.57 2.3,18.6 2.45,18.45 U$10.P$10
  Bottom 0.1: U$6.P$42 5.05,21.68 5.18,21.81 5.18,22.22 4.96,22.44 4.91,22.44 4.43,22.92 0.89,22.92 0.66,22.7 v0.65,22.7
BOOT0
  Bottom 0.15: U$8.P$1 6.15,22.4 | 6.15,22.4 R_BOOT.1 | U$6.P$44 6.05,22.3 6.15,22.4
DAC1  (via drill 0.2)
  Top 0.102: R_TEST.2 v2.8,10.42
  Route2 0.102: v2.8,10.42 2.8,10.18 2.32,9.7 1.88,9.7 1.6,9.98 1.6,11.65 2.35,12.4 7.3,12.4 7.6,12.7 v7.6,13.8
  Bottom 0.102: v7.6,13.8 7.55,13.85 U$6.P$14
DGND  (via drill 0.2)
  Top 0.1: C1.1 U$14.P$7 8.08,16.82 7.03,16.82 v6.88,16.97 | v3.05,16.1 3.23,15.93 3.23,15.92 3.71,15.43 U$10.P$6
  Top 0.15: U$11.P$2 14.95,18.15 | C9.1 14.95,18.15 | v12.15,20.2 12.5,19.85 U$13.P$1 | v9.05,22.7 9.05,22.06 U$12.G$2 | 14.95,18.15 v14.95,18.55
  Top 0.152: C3.1 v14.95,18.55
  Top 0.2: U$14.P$3 U$14.P$4 | C26.1 6.7,13.45 v6.55,13.3 | U$12.G$1 3.75,22.35 | R4.1 R6.1 | v9.74,15.21 9.71,15.24 U$4.A2 | C19.1 12.5,19.07 12.5,19.15
  Top 0.3: v12.8,18.5 12.5,18.8 12.5,19.15 U$13.P$1 | U$12.P$4 7.85,20.3 8.03,20.47 8.03,20.53 v8.1,20.6
  Bottom 0.1: v6.88,16.97 7.11,17.2 7.4,17.2 | C24.1 0.65,21.75 v0.6,21.8 | R_BOOT.2 v5.24,22.7 | U$6.HEAT 5.47,17.78 | U$6.P$47 7.6,21.32 7.6,21.09 8.09,20.6 v8.1,20.6 | C98.2 11.35,16.2 U$15.P$4 | U$3.P$1 11.7,13 11.7,13.85 11.75,13.8 U$3.P$1
  Bottom 0.15: U$15.P$2 10.72,17.12 10.72,16.98 11.15,16.55 U$15.P$4 | U$6.HEAT 5.3,17.3 4.28,16.28 | U$7.A1 1.65,13.71 1.65,13.73 1.6,13.77 v1.6,14.15 | U$20.P$6 U$20.P$7 12.15,20.12 v12.15,20.2 12.7,20.75 12.7,20.85 13.25,21.4 U$20.P$1 v14.3,21.4 | C25.1 9.1,22.65 v9.05,22.7
  Bottom 0.152: U$6.P$35 2.28,20.2 2.48,20.4 2.82,20.4 3.2,20.02 3.2,19.55 5.35,17.4
  Bottom 0.2: U$6.P$23 C23.1 C8.2 3.02,13.38 2.34,13.38 2.11,13.6 U$7.A1 | U$3.H4 11.75,12.72 U$3.P$1 | U$6.P$8 7.4,17.2 6.05,17.2 5.47,17.78 | U$6.HEAT 5.35,17.9 5.35,17.4 5.35,16.93 4.93,16.93 4.28,16.28 | v0.85,15.4 0.85,14.48 0.83,14.46 0.83,13.68 C11.2 | U$5.A1 12.95,16.6 C7.2 | U$3.P$6 6.25,13 v6.55,13.3 | v14.3,21.4 14.36,21.4 R11.1 | C6.2 12.9,18.4 v12.8,18.5
  other vias: 13.45,14.2 11.7,14.15 14.55,15.7 4.14,17.43 5.5,16.3 4.2,18.95 10.45,17.4 4,19.95 14.55,22.15 3,7.15 12.6,6.85 12.95,15.9
  pour Bottom (isolate 0.1, no thermals): -0.1,26.25 -0.1,-0.1 15.8,-0.1 15.8,26.25
  pour Route15 (isolate 0.1, no thermals): -0.05,23.75 -0.05,-1.25 17.65,-1.25 17.65,23.75
  pour Top (isolate 0.1, no thermals): -0.8,23.7 -0.8,13.9 16.1,13.9 16.1,23.7
  pour Route2 (isolate 0.1, no thermals): -0.65,23.85 -0.65,14.05 16.75,14.05 16.75,23.85
GND  (via drill 0.2, 0.2 layers 1-2)  (1 unrouted)
  Top 0.102: S1.B1 13.35,3.51 13.35,2.8 | S1.T18 2.5,5.55 v2.55,5.6 | 9.11,13.5 R4.2 | C5.2 0.5,10.25 0.65,10.1 v0.65,9.15 0.67,9.15 0.89,8.92 1.41,8.92 1.63,9.14 1.63,10.32 1.6,10.35 U$9.A1 | U$1.J17 U$1.K16 U$1.L16 | U$1.L14 U$1.L13 U$1.L12 U$1.L11 U$1.L10 U$1.L9 U$1.L8 U$1.L7 U$1.L6 | U$1.L6 U$1.M6 | U$1.L6 U$1.L5 U$1.L4 U$1.L3 | U$1.K2 U$1.K1 U$1.J1
  Top 0.15: v14.75,9.9 14.35,10.3 14.35,10.35 14,10.7 12.9,10.7 12.5,11.1 12.5,11.95 12.1,12.35 U$1.M1 | U$1.J1 12.75,10 v12.8,10
  Top 0.152: R9.2 v14.75,9.9
  Top 0.2: C16.2 2.64,11.84 C4.2 3.44,11.84 3.45,11.85 U$1.L17 U$1.L16 | R6.2 10.69,13.5 10.82,13.62 13.82,13.62 v13.85,13.6 | 9.05,13.9 9.05,13.6
  Route2 0.15: v12.8,10 13.25,10 13.57,9.68 13.93,9.68 14.15,9.9 v14.75,9.9
  Route2 0.2: v13.85,13.6 13.85,11.8 14.05,11.6 14.05,11.34 14.03,11.32 14.03,10.62 v14.75,9.9
  Route2 0.3: v13.85,13.6 13.85,13.89 13.95,13.99 13.95,14.03 U$18.P$2
  Route15 0.15: v13.25,2.8 13.25,2.4 12.05,1.2 v7.55,1.2 3.1,1.2 1.83,2.47 1.83,4.93 2.5,5.6 v2.55,5.6
  Bottom 0.102: S3.B1 2.5,3.8 2.16,4.14 2.16,5.28 2.48,5.6 v2.55,5.6 | 13.3,5.05 S3.T18 13.3,5.09 12.85,5.53 12.85,6 12.95,6.1 13.38,6.1 13.84,5.64 13.84,3.32 13.3,2.78 13.27,2.78 v13.25,2.8
  other vias: 7.1,10.05 8.75,11.15
  pour Top (isolate 0.1): -1,13.5 -1,-1.3 16.25,-1.3 16.25,13.5
  pour Route2 (isolate 0.1, no thermals): -1.15,13.75 -1.15,-1.2 16.75,-1.2 16.75,13.75
GPIO0
  Bottom 0.15: U$6.P$30 1.57,17.7 1.27,17.39 0.78,17.39 0.6,17.58 0.6,19.31 U$17.P$2
GPIO1  (via drill 0.2)
  Top 0.1: v1.1,17.84 1.1,18.86 1.58,19.34 1.58,20.21 U$17.P$1
  Bottom 0.15: U$6.P$31 1.85,18.18 1.38,18.18 1.1,17.9 v1.1,17.84
HJ_MODE  (via drill 0.2)
  Top 0.1: v9.45,19.7 9.45,19.68 9.03,19.25 9.03,18.95 9.42,18.55 9.42,17.16 10.04,16.55 10.04,15.79 10.12,15.72 10.12,14.9 10.03,14.82 9.48,14.82 8.79,15.5 5.04,15.5 4.89,15.65 4.89,16.54 4.6,16.83 3.42,16.83 3.33,16.91 2.92,16.91 2.73,17.11 2.35,17.11 2.04,17.43 0.61,17.43 0.48,17.29 0.48,14.49 | U$10.P$3 2.6,12.85 2.55,12.8 1.34,12.8 1.12,13.02 1.12,13.84
  Top 0.102: 1.12,13.84 0.96,14 0.55,14 0.48,14.08 0.48,14.49
  Bottom 0.15: U$6.P$3 v9.45,19.7
HJ_WAKE  (via drill 0.2)
  Top 0.1: v9.4,19.1 9.41,19.1 9.62,18.89 9.62,17.24 10.24,16.63 10.24,15.88 10.31,15.8 10.31,14.82 10.01,14.52 9.34,14.52 8.56,15.3 4.96,15.3 4.69,15.56 4.69,15.84 4.6,15.93 3.75,15.93 3.21,16.48 2.9,16.48 2.47,16.05 2.07,16.05 1.85,15.83 1.85,15.52 2.07,15.3 2.69,15.3 3.56,14.43 U$10.P$5
  Bottom 0.15: U$6.P$4 9.3,19.2 v9.4,19.1
I2C1_SCL  (via drill 0.2 layers 2-16)
  Route15 0.15: v6.5,20.85 6.56,20.85 7.12,21.41 8.66,21.41 9.95,22.7 v10.05,22.7
  Bottom 0.102: U$6.P$45 6.55,20.9 v6.5,20.85
  Bottom 0.15: U$20.P$13 12.2,22.4 11.99,22.61 10.15,22.61 R2.2 10.05,22.5 v10.05,22.7
I2C1_SDA  (via drill 0.2 layers 2-16)
  Route15 0.15: v7.15,20.84 7.38,21.06 8.81,21.06 10.03,22.27 10.23,22.27 10.65,22.7 v12.53,22.7
  Bottom 0.102: U$6.P$46 7.05,20.94 v7.15,20.84
  Bottom 0.15: R5.2 12.74,22.65 | 12.74,22.65 12.74,21.87 U$20.P$14 | v12.53,22.7 12.7,22.7 12.74,22.65
IN0  (via drill 0.2, 0.2 layers 1-2)
  Top 0.1: v10.75,11 11.25,11 U$1.J2 | v8.25,2.7 8.25,2.62 10.07,0.8 14.33,0.8 15.25,1.72 15.25,6.98 13.75,8.48 v13.75,10.1
  Route2 0.1: v10.75,11 10.95,10.8 11.12,10.8 11.4,10.52 11.4,10 12.7,8.7 13.01,8.7 14.85,6.86 14.85,2.14 13.71,1 9.74,1 8.25,2.48 v8.25,2.7
  Bottom 0.1: v8.25,2.7 8.25,3.5 8.21,3.56
  Bottom 0.152: S3.B10 8.21,3.56
IN1
  Top 0.1: S1.B9 8.3,3.48 8.3,3.25 10.55,1 14.25,1 15.05,1.8 15.05,6.87 12.42,9.49 12.42,9.79 11.9,10.31 U$1.I1
IN2  (via drill 0.2 layers 1-2, 0.2 layers 2-16)
  Top 0.1: U$1.I2 11.35,10.4 v10.95,10.4
  Route2 0.1: v10.95,10.4 10.95,10.15 12.6,8.5 12.93,8.5 14.65,6.78 14.65,2.22 13.63,1.2 10.09,1.2 8.85,2.43 v8.85,2.45
  Bottom 0.1: S3.B11 v8.85,2.45
IN3
  Top 0.1: 11.05,1.2 11.37,1.2 14.15,1.2 14.85,1.9 14.85,6.78 12.22,9.41 12.22,9.49 11.9,9.81 U$1.H1
  Top 0.102: S1.B8 8.85,3.4 11.05,1.2
IN4  (via drill 0.2 layers 1-2, 0.2 layers 2-16)
  Top 0.1: U$1.H2 10.9,9.85 10.55,10.2 10.55,10.3 10.35,10.5 v9.65,10.5
  Route2 0.1: v9.5,2.8 9.75,2.55 9.75,2.43 10.79,1.4 13.55,1.4 14.45,2.3 14.45,6.7 12.9,8.25 12.53,8.25 10.55,10.23 10.55,10.27 10.32,10.5 v9.65,10.5
  Bottom 0.1: S3.B12 9.49,2.81 v9.5,2.8
IN5
  Top 0.1: U$1.G1 11.95,9.4 14.65,6.7 14.65,2 14.05,1.4 11.45,1.4
  Top 0.102: 11.45,1.4 9.49,3.36 S1.B7
IN6  (via drill 0.2 layers 1-2, 0.2 layers 2-16)
  Top 0.1: U$1.G2 11.35,9.4 11.05,9.4 10.45,10 10.15,10 v10.15,10.1
  Route2 0.1: v10.15,10.1 10.35,9.9 10.6,9.9 12.5,8 12.87,8 14.25,6.62 14.25,2.38 13.46,1.6 11.39,1.6 10.38,2.6 v10.15,2.6
  Bottom 0.1: S3.B13 10.12,2.63 v10.15,2.6
IN7
  Top 0.1: 11.85,1.6 13.95,1.6 14.45,2.1 14.45,6.6 12.15,8.9 11.95,8.9 U$1.F1
  Top 0.102: 11.85,1.6 10.12,3.33 S1.B6
IN8  (via drill 0.2 layers 1-2, 0.2 layers 2-16)
  Top 0.1: U$1.F2 11.35,8.9 11.25,8.9 10.45,9.7 10.05,9.7 9.95,9.6 9.75,9.6 v9.65,9.7
  Route2 0.1: v10.75,2.8 10.75,2.68 10.75,2.65 10.75,2.58 11.54,1.8 13.38,1.8 14.05,2.47 14.05,6.53 12.83,7.75 12.37,7.75 10.42,9.7 v9.65,9.7
  Bottom 0.1: S3.B14 v10.76,2.81 v10.75,2.8
IN9
  Top 0.1: U$1.E1 11.95,8.4 12.35,8.4 14.25,6.5 14.25,2.2 13.85,1.8 12.35,1.8 10.75,3.4 10.75,3.5 S1.B5
IN10  (via drill 0.2 layers 1-2, 0.2 layers 2-16)
  Top 0.1: U$1.E2 11.35,8.3 10.65,9 10.35,9 10.25,9.1 v10.25,9.3
  Route2 0.1: v10.25,9.3 10.35,9.3 12.15,7.5 12.8,7.5 13.85,6.45 13.85,2.55 13.3,2 11.99,2 11.4,2.58 v11.4,2.6
  Bottom 0.1: S3.B15 v11.39,2.61 v11.4,2.6
IN11
  Top 0.1: S1.B4 11.35,3.5 11.35,3.4 12.75,2 13.75,2 14.05,2.3 14.05,6.4 12.55,7.9 11.95,7.9 U$1.D1
  Top 0.2: S1.B4
IN12  (via drill 0.2 layers 1-2, 0.2 layers 2-16)
  Top 0.1: U$1.D2 11.35,7.9 | 10.13,8.89 10.02,9 v9.55,9
  Top 0.102: 11.35,7.9 11.05,8.2 11.05,8.28 10.54,8.8 10.22,8.8 10.13,8.89
  Route2 0.1: 10.25,8.8 10.22,8.8 10.12,8.9 9.65,8.9 v9.55,9
  Route2 0.102: v12.05,2.8 12.05,2.48 12.33,2.2 13.22,2.2 13.65,2.63 13.65,6.37 12.77,7.25 12.05,7.25 10.5,8.8 10.25,8.8
  Bottom 0.102: S3.B16 12.03,2.82 v12.05,2.8
IN13
  Top 0.1: U$1.C1 11.95,7.4 12.75,7.4 13.85,6.3 13.85,2.4 13.65,2.2 12.95,2.2 12.05,3.1 12.05,3.5 S1.B3
IN14  (via drill 0.2 layers 1-2, 0.2 layers 2-16)
  Top 0.1: v9.95,8.5 10.55,8.5 10.85,8.2 10.85,7.9 11.35,7.4 11.35,7.35 11.38,7.33 U$1.C2
  Route2 0.102: v9.95,8.5 10.05,8.4 10.62,8.4 10.85,8.17 10.85,7.97 12.65,6.17 v12.65,2.6
  Bottom 0.102: S3.B17 12.66,2.61 v12.65,2.6
IN15
  Top 0.1: U$1.B1 12.5,6.25 13.6,6.25 13.65,6.2 13.65,2.5 13.55,2.4 13.05,2.4 12.65,2.8 12.65,3.5 S1.B2
IN16
  Top 0.1: U$1.A1 11.9,6.25 12.65,5.5 12.65,4.8 S1.T2
  Top 0.2: S1.T2
IN17  (via drill 0.2 layers 1-2, 0.2 layers 2-16)
  Top 0.1: 10.95,7.4 10.95,7.5 v10.45,8
  Top 0.102: 10.95,7.4 10.95,7.3 U$1.B2
  Route2 0.1: v10.45,8 10.7,7.75 10.72,7.75 12.15,6.32 v12.15,6.1
  Bottom 0.1: S3.T17 12.66,5.44 12.65,5.45 12.15,5.95 v12.15,6.1
IN18
  Top 0.1: U$1.A2 11.4,6.15 12.05,5.5 12.05,4.8 S1.T3
  Top 0.2: S1.T3
IN19  (via drill 0.2 layers 1-2, 0.2 layers 2-16)
  Top 0.1: U$1.B3 10.55,7.2 v10.55,7.35
  Route2 0.1: v11.95,5.5 11.7,5.75 11.7,6.12 10.55,7.27 v10.55,7.35
  Bottom 0.1: S3.T16 11.95,4.79 v11.95,5.5
IN20
  Top 0.1: U$1.A3 10.9,6.15 11.35,5.7 11.35,4.8 11.4,4.72
  Top 0.2: S1.T4 11.4,4.72
IN21  (via drill 0.2 layers 1-2, 0.2 layers 2-16)
  Top 0.1: U$1.B4 10.15,7.1 10.15,7.5 v9.75,7.9
  Route2 0.1: v11.3,5.95 10.15,7.1 10.15,7.47 9.75,7.87 v9.75,7.9
  Bottom 0.1: S3.T15 11.39,5.86 v11.3,5.95
IN22
  Top 0.1: U$1.A4 10.4,6.15 10.75,5.8 10.75,4.8 S1.T5
  Top 0.2: S1.T5
IN23  (via drill 0.2 layers 1-2, 0.2 layers 2-16)
  Top 0.1: v9.75,7.3 9.75,7 U$1.B5
  Route2 0.1: v10.7,5.5 10.45,5.75 10.45,5.97 9.75,6.67 v9.75,7.3
  Bottom 0.1: S3.T14 10.7,4.77 v10.7,5.5
IN24
  Top 0.102: S1.T6 10.12,5.93 9.9,6.15 U$1.A5
IN25  (via drill 0.2 layers 1-2, 0.2 layers 2-16)
  Top 0.1: U$1.B6 9.35,6.9 9.35,7.5 8.95,7.9 v8.85,7.9
  Route2 0.1: v8.85,7.9 8.85,7.87 9.25,7.47 9.25,6.6 v10.05,5.8
  Bottom 0.1: S3.T13 10.12,5.73 v10.05,5.8
IN26
  Top 0.102: S1.T7 9.4,4.8 U$1.A6
IN27  (via drill 0.2 layers 1-2, 0.2 layers 2-16)
  Top 0.1: U$1.B7 8.85,6.9 v8.85,7.3
  Route2 0.1: v9.45,5.55 9.45,5.95 8.85,6.55 v8.85,7.3
  Bottom 0.1: S3.T12 9.49,5.51 v9.45,5.55
IN28
  Top 0.1: 8.85,6.3 U$1.A7
  Top 0.102: 8.85,6.3 S1.T8
IN29  (via drill 0.2 layers 1-2, 0.2 layers 2-16)
  Top 0.1: U$1.B8 8.45,6.9 8.45,7.6 8.15,7.9 v8.05,7.9
  Route2 0.1: v8.05,7.9 8.05,7.87 8.45,7.47 8.45,6.2 v8.8,5.85
  Bottom 0.1: S3.T11 8.8,4.76 v8.8,5.85
IN30
  Top 0.1: U$1.A8 8.4,6.25 8.3,6.15
  Top 0.102: S1.T9 8.22,6.07 8.3,6.15
IN31  (via drill 0.2 layers 1-2, 0.2 layers 2-16)
  Top 0.1: U$1.B9 7.9,7.15 v8.05,7.3
  Route2 0.1: v8.2,5.5 8.2,6.05 8,6.25 8,7.25 v8.05,7.3
  Bottom 0.1: S3.T10 8.22,5.48 v8.2,5.5
IN32
  Top 0.1: U$1.A9 7.9,6.15
  Top 0.102: S1.T10 7.58,5.83 7.9,6.15
IN33
  Top 0.1: U$1.A10 7.4,6.15 6.95,5.7 6.95,4.8 S1.T11
IN34  (via drill 0.2 layers 1-2, 0.2 layers 2-16)
  Top 0.1: U$1.B10 7.65,7.1 7.65,7.65 v7.35,7.95
  Route2 0.1: v7.5,5.85 7.5,6.28 7.65,6.43 7.65,7.65 v7.35,7.95
  Bottom 0.1: S3.T9 7.58,5.77 v7.5,5.85
IN35
  Top 0.1: U$1.A11 6.9,6.15 6.35,5.6
  Top 0.102: S1.T12 6.31,5.56 6.35,5.6
IN36  (via drill 0.2 layers 1-2, 0.2 layers 2-16)
  Top 0.1: v7.25,7.35 7.25,7.2 U$1.B11
  Route2 0.1: v6.9,5.55 6.9,5.95 7.25,6.3 v7.25,7.35
  Bottom 0.1: S3.T8 6.95,5.5 v6.9,5.55
IN37
  Top 0.1: U$1.A12 6.4,6.15 5.65,5.4 5.65,4.8 5.66,4.71 S1.T13
IN38  (via drill 0.2 layers 1-2, 0.2 layers 2-16)
  Top 0.1: 6.85,7.27 6.85,7.6 6.75,7.7 v6.75,8
  Top 0.102: U$1.B12 6.43,6.85 6.85,7.27
  Route2 0.1: v6.75,8 6.77,8 6.85,7.92 6.85,7.13 6.25,6.53 v6.25,6.15
  Bottom 0.1: 6.25,4.77 v6.25,6.15
  Bottom 0.152: S3.T7 6.25,4.77
IN39
  Top 0.1: U$1.A13 5.9,6.15 5.05,5.3
  Top 0.102: S1.T14 5.04,5.29 5.05,5.3
IN40  (via drill 0.2 layers 1-2, 0.2 layers 2-16)
  Top 0.1: U$1.B13 v6.45,7.4
  Route2 0.1: v5.6,5.7 5.6,6.55 v6.45,7.4
  Bottom 0.1: S3.T6 5.68,5.62 v5.6,5.7
IN41
  Top 0.1: U$1.A14 5.4,6.15 4.45,5.2 4.45,4.8 4.42,4.75 4.41,4.74 S1.T15
IN42  (via drill 0.2 layers 1-2, 0.2 layers 2-16)
  Top 0.1: U$1.B14 6.1,7.55 v6.1,7.9
  Route2 0.1: v4.9,6 4.95,6.05 4.95,6.43 5.95,7.43 5.95,7.75 v6.1,7.9
  Bottom 0.1: S3.T5 4.9,4.85 v4.9,6
IN43
  Top 0.1: U$1.A15 4.9,6.15 3.75,5 3.76,4.8 S1.T16
IN44  (via drill 0.2 layers 1-2, 0.2 layers 2-16)
  Top 0.1: U$1.B15 5.05,7 | 5.5,7.5 5.5,7.55 v5.55,7.6
  Top 0.102: 5.05,7 5.07,7.02 5.11,7.02 5.5,7.42 5.5,7.5
  Route2 0.1: v5.55,7.6 5.35,7.4 5.35,7.23 4.3,6.18 v4.3,5.65
  Bottom 0.1: S3.T4 4.3,4.82 v4.3,5.65
IN45
  Top 0.1: U$1.A16 4.4,6.25 3.15,5 3.15,4.8 S1.T17
IN46  (via drill 0.2 layers 1-2, 0.2 layers 2-16)
  Top 0.1: U$1.B16 v4.95,7.4
  Route2 0.1: v3.78,6.23 3.88,6.23 4.95,7.3 v4.95,7.4
  Bottom 0.1: S3.T3 v3.77,6.22 v3.78,6.23
IN47
  Top 0.1: U$1.A17 3.85,6.4 2.25,6.4 2.15,6.3 2.15,2.5 2.25,2.4 2.85,2.4 3.15,2.7 3.15,3.5 S1.B17
IN48
  Top 0.1: S1.B16 3.75,3.5 3.75,2.8 3.15,2.2 2.15,2.2 1.95,2.4 1.95,6.35 1.95,6.38 2.17,6.6 3.65,6.6 U$1.B17
IN49  (via drill 0.2 layers 1-2, 0.2 layers 2-16)
  Top 0.1: 4.5,7.49 4.5,7.45 U$1.C16 | 5.01,8 v5.05,8
  Top 0.102: 4.5,7.49 5.01,8
  Route2 0.1: v3.35,5.7 3.35,6.44 3.57,6.65 3.63,6.65 4.92,7.93 4.92,8 v5.05,8
  Bottom 0.1: S3.T2 3.14,5.37 3.18,5.41 3.18,5.52 v3.35,5.7
IN50
  Top 0.1: 4.45,3.2 4.45,2.9 3.55,2 2.05,2 1.75,2.3 1.75,6.5 2.77,7.52 3.15,7.52 3.33,7.35 U$1.C17 | 4.45,3.2 4.45,3.3 4.41,3.34 S1.B15 4.41,3.24 4.45,3.2
IN51  (via drill 0.2 layers 1-2, 0.2 layers 2-16)
  Top 0.1: 5.15,8.5 5.4,8.5 v5.6,8.3
  Top 0.102: U$1.D16 4.67,8.12 4.67,8.16 5.02,8.5 5.15,8.5
  Route2 0.1: v3.15,2.8 3.15,5.34 2.95,5.53 2.95,6.32 4.35,7.72 4.35,7.87 4.88,8.4 5.6,8.4 v5.6,8.3
  Bottom 0.1: S3.B2 3.14,2.81 v3.15,2.8
IN52
  Top 0.1: 5.06,3.01 3.85,1.8 1.95,1.8 1.55,2.2 1.55,6.58 2.82,7.85 U$1.D17
  Top 0.102: S1.B14 5.06,3.54 5.06,3.01
IN53  (via drill 0.2 layers 1-2, 0.2 layers 2-16)
  Top 0.1: U$1.E16 4.45,8.3 5.05,8.9 v5.15,8.9
  Route2 0.1: v5.15,8.9 3.8,8.9 2.15,7.25 2.15,2.63 2.38,2.4 3.32,2.4 3.42,2.5 v3.75,2.5
  Bottom 0.1: v3.75,2.5 3.75,3.54 S3.B3
IN54
  Top 0.1: 5.66,3.11 4.15,1.6 1.85,1.6 1.35,2.1 1.35,6.67 3.03,8.35 U$1.E17
  Top 0.102: S1.B13 5.68,3.13 5.66,3.11
IN55  (via drill 0.2 layers 1-2, 0.2 layers 2-16)
  Top 0.1: U$1.F16 4.45,8.8 4.95,9.3 5.35,9.3 v5.75,8.9
  Route2 0.1: v4.4,2.85 4.4,2.58 3.92,2.1 2.4,2.1 1.95,2.55 1.95,7.33 3.92,9.3 5.32,9.3 5.72,8.9 v5.75,8.9
  Bottom 0.1: S3.B4 v4.41,2.86 v4.4,2.85
IN56
  Top 0.1: 4.45,1.4 1.75,1.4 1.15,2 1.15,6.75 3.25,8.85 U$1.F17
  Top 0.102: 4.45,1.4 6.31,3.26 S1.B12
IN57  (via drill 0.2 layers 1-2, 0.2 layers 2-16)
  Top 0.1: U$1.G16 4.45,9.4 4.75,9.4 v5.05,9.7
  Route2 0.1: v5.05,9.7 4.04,9.7 1.75,7.41 1.75,2.47 2.32,1.9 4.52,1.9 5.05,2.43 v5.05,2.5
  Bottom 0.1: S3.B5 v5.04,2.51 v5.05,2.5
IN58
  Top 0.1: S1.B11 6.95,3.5 6.95,3.2 6.55,2.8 6.35,2.8 4.75,1.2 1.65,1.2 0.95,1.9 0.95,6.83 3.47,9.35 U$1.G17
IN59  (via drill 0.2 layers 1-2, 0.2 layers 2-16)
  Top 0.1: U$1.H16 4.6,9.85 4.85,10.1 5.25,10.1 5.45,9.9 5.45,9.8 5.55,9.7 v5.65,9.7
  Route2 0.1: v5.65,2.9 5.65,2.53 4.82,1.7 2.24,1.7 1.55,2.39 1.55,7.5 4.15,10.1 5.22,10.1 5.62,9.7 v5.65,9.7
  Bottom 0.1: S3.B6 5.68,2.93 v5.65,2.9
IN60
  Top 0.1: 7.59,3.56 7.55,3.5 7.55,3.1 7.05,2.6 6.75,2.6 5.15,1 1.55,1 0.75,1.8 0.75,6.91 3.69,9.85 U$1.H17
  Top 0.152: 7.55,3.5 7.58,3.53 S1.B10 7.59,3.56
IN61  (via drill 0.2 layers 1-2, 0.2 layers 2-16)
  Top 0.1: U$1.I16 4.55,10.5 v4.85,10.5
  Route2 0.1: v4.85,10.5 4.27,10.5 1.35,7.58 1.35,2.3 2.15,1.5 5.4,1.5 6.3,2.4 v6.3,2.5
  Bottom 0.1: S3.B7 6.31,2.51 v6.3,2.5
IN62  (via drill 0.2)
  Top 0.1: v7.55,2.2 6.93,2.2 5.53,0.8 1.47,0.8 0.55,1.72 0.55,7 3.35,9.8 U$1.I17
  Bottom 0.1: v7.55,2.2 7.55,3.52
  Bottom 0.152: S3.B9 7.58,3.55 7.55,3.52
IN63  (via drill 0.2 layers 1-2, 0.2 layers 2-16)
  Top 0.1: U$1.J16 4.45,10.9 5,10.9 5.35,10.55 5.35,10.5 v5.45,10.5
  Route2 0.1: v6.95,2.9 6.9,2.85 6.9,2.53 5.67,1.3 2.07,1.3 1.15,2.22 1.15,7.66 4.39,10.9 5.02,10.9 5.42,10.5 v5.45,10.5
  Bottom 0.1: S3.B8 v6.95,2.9
INTAN_CS  (via drill 0.2)
  Top 0.15: U$1.M8 8.3,12.45 v8.3,13.95
  Bottom 0.152: U$6.P$13 8.05,14.03 8.12,13.95 v8.3,13.95
INTAN_MISO  (via drill 0.2)
  Top 0.1: U$1.M14 5.36,12.35 4.91,12.8 3.24,12.8 3.1,12.94 3.1,13.35 | v1.24,16.15 1.24,16.1 1.45,15.89 1.45,15.35 1.91,14.9 2.52,14.9 3.1,14.33 3.1,13.35 | 3.1,13.35
  Bottom 0.15: U$6.P$11 8.35,15.7 8.17,15.53 2.94,15.53 2.24,16.23 1.9,16.23 U$6.P$27 1.83,16.15 v1.24,16.15
INTAN_MOSI  (via drill 0.2)
  Top 0.1: v1.25,16.75 1.43,16.57 1.44,16.57 1.65,16.36 1.65,15.44 1.99,15.1 2.61,15.1 3.71,14 3.96,14 4.1,13.86 4.1,13.35 4.35,13.1 5.61,13.1 6.36,12.35 U$1.M12
  Bottom 0.1: v1.25,16.75 1.3,16.7 U$6.P$28
INTAN_REF
  Top 0.1: U$1.M17 3.87,12.34 3.86,12.34 C4.1
INTAN_SCK  (via drill 0.2)
  Top 0.1: U$1.M10 6.92,12.83 6.39,12.83 6.05,13.17 6.05,14.2 5.95,14.3 5.02,14.3 4.69,14.63 4.69,14.84 4.6,14.93 3.78,14.93 3.03,15.68 v2.23,15.68
  Bottom 0.15: U$6.P$21 4.07,14.55 4.07,15.17 3.97,15.28 2.79,15.28 2.37,15.7 2.3,15.7 | 2.3,15.7 U$6.P$26 | v2.23,15.68 2.27,15.68 2.3,15.7
LED  (via drill 0.2)
  Top 0.1: v9.7,20.3 9.73,20.3 9.82,20.21 9.82,17.38 10.6,16.61 R3.2
  Bottom 0.1: v9.7,20.3 8.82,20.3 U$6.P$2
N$1
  Bottom 0.15: U$20.P$2 U$20.P$3 14.55,20.4 R10.2
  Bottom 0.2: 14.55,20.4 R11.2
N$7
  Top 0.152: U$22.P$5 11.54,16.05 R13.2 R12.1
N$11
  Top 0.2: U$16.P$2 10.65,15.1 R3.1
OSC0
  Bottom 0.1: C99.2 10.4,18.05
  Bottom 0.15: U$6.P$5 9.1,18.7 9.75,18.05 10.4,18.05 11.05,18.05 11.15,17.95 U$15.P$3
OSC1
  Bottom 0.1: C98.1 10.45,16 U$15.P$1
  Bottom 0.15: U$6.P$6 9.2,18.2 9.75,17.65 9.75,16.55 9.9,16.4 10.25,16.4 U$15.P$1
RAM_CS  (via drill 0.2)
  Top 0.1: v2.02,21.83 2.02,21.84 1.9,21.96 1.9,22.64 2.16,22.9 4.32,22.9 4.4,22.82 4.4,21.57 4.55,21.43 7.37,21.43 7.72,21.07 7.72,20.6 7.4,20.27 7.4,18.46 7.2,18.25 6.9,18.25 5.95,17.3 U$14.P$1
  Bottom 0.1: U$6.P$38 3.05,21.05 3,21
  Bottom 0.15: 3,21 2.97,20.98 2.33,20.98 2.02,21.28 v2.02,21.82 v2.02,21.83
RAM_MISO  (via drill 0.2)
  Top 0.1: U$14.P$2 5.04,16.8 4.95,16.89 4.95,17.51 5.04,17.6 5.97,17.6 6.82,18.45 7.11,18.45 7.2,18.54 7.2,20.36 7.53,20.68 7.53,20.99 7.29,21.23 4.52,21.23 4.15,20.86 v4.12,20.86
  Bottom 0.1: R7.1 3.69,22.14 4.05,21.79 U$6.P$40
  Bottom 0.15: U$6.P$40 4.05,20.93 v4.12,20.86
RAM_MOSI  (via drill 0.2)
  Top 0.1: v4.81,22.07 4.81,21.77 4.95,21.62 7.71,21.62 8.47,20.86 8.47,18.78 7.75,18.05 7.3,18.05 6.5,17.25 6.5,16.74 7.39,15.85 8.05,15.85 U$14.P$5 9.08,15.8 U$4.B2
  Bottom 0.1: U$6.P$41 4.55,21.81 v4.81,22.07 4.47,22.4 R7.2
RAM_SCK  (via drill 0.2)
  Top 0.1: v8.07,16.3 U$14.P$6 9,16.3 U$4.B1
  Route15 0.1: v8.07,16.3 8.07,16.34 4.91,19.5 3.88,19.5 3.5,19.88 v3.5,20.85
  Bottom 0.1: U$6.P$39 3.5,21.32 v3.5,20.85
REF  (via drill 0.2)
  Top 0.102: S1.T1 13.3,5.65 v13.25,5.7 | S1.B18 2.55,3.52 v2.55,2.8 | R9.1 14.13,8.5 14.13,10.26 13.91,10.48 12.77,10.48 12.23,11.02 12.23,11.49 11.9,11.81 U$1.L1
  Top 0.152: R9.1 14.8,8.45 v14.6,8.45
  Route15 0.102: v14.6,8.45 13.25,7.1 v13.25,5.7 13.25,5.53 11.92,4.2 3.95,4.2 v2.55,2.8
  Bottom 0.102: S3.B18 13.3,3.8 13.64,4.14 13.64,5.41 13.35,5.7 v13.25,5.7 | v2.55,2.8 2.53,2.78 2.5,2.78 1.96,3.32 1.96,5.84 2.09,5.98 2.91,5.98 2.98,5.91 2.98,5.49 2.5,5.02 S3.T1
SD_CS
  Bottom 0.2: U$3.P$2 8.78,14.83 U$6.P$12
SD_DET
  Bottom 0.1: U$6.P$18 5.55,14.31 4.65,13.41 4.65,12.3 4.95,12 7.75,12 8.1,12.35 U$3.G
SD_MISO
  Bottom 0.15: U$3.P$7 5.15,13.4 5.6,13.85 6.25,13.85 6.55,14.15 U$6.P$16
SD_MOSI
  Bottom 0.15: U$3.P$3 9.53,12.98 9.53,13.67 7.97,15.23 6.12,15.23 6.05,15.15 U$6.P$17
SD_SCK
  Bottom 0.15: U$3.P$5 7.35,13.4 7.1,13.65 7.1,14.48 U$6.P$15
SWCLK
  Bottom 0.1: U$6.P$37 2.55,21.77 2.5,21.82 2.5,22.3 U$2.P$1
SWDIO  (via drill 0.2)
  Top 0.1: U$2.P$2 1.33,22.43 1.33,21.7 1.98,21.05 1.98,20.18 2.25,19.9 v2.6,19.9
  Bottom 0.15: U$6.P$34 2.43,19.7 2.6,19.88 v2.6,19.9
USB_D+  (via drill 0.2)
  Top 0.1: U$12.P$3 6.85,20.26 6.71,20.4 5.54,20.4 5.45,20.31 5.45,18.55 5.04,18.15 4.05,18.15 4,18.1 4,17.99 3.91,17.9 3.29,17.9 3.1,18.09 3.1,19.01 2.94,19.18 v2.7,19.18
  Bottom 0.1: v2.7,19.18 1.9,19.18 U$6.P$33
USB_D-  (via drill 0.2)
  Top 0.1: U$12.P$2 5.85,18.67 5.13,17.95 5.08,17.95 4.69,17.56 4.69,17.12 4.6,17.03 3.5,17.03 3.41,17.12 3.01,17.12 2.64,17.48 v2.52,17.48
  Bottom 0.1: U$6.P$32 2.21,18.7 2.52,18.39 v2.52,17.48
V12  (via drill 0.2)
  Top 0.2: C26.2 5.25,13.85 v4.5,13.85
  Bottom 0.15: U$6.P$22 3.59,14.49
  Bottom 0.2: 3.59,14.49 3.6,14.48 3.6,14.17 3.92,13.85 v4.5,13.85
VBATT  (via drill 0.2)
  Top 0.11: R1.1 1.1,12.51 v0.93,12.68
  Top 0.152: U$22.P$4 11.36,17 R12.2 11.25,17.62 C19.2 10.62,18.44 v11.1,18.92
  Top 0.2: U$22.P$4 12.05,17.26 12.44,17.65 12.45,17.65 SB$1.1
  Route15 0.3: v0.93,12.68 0.93,14.68 1.5,15.24 1.5,15.65 2.02,16.18 2.02,17.69 3.2,18.87 3.2,20.44 3,20.64 3,21.06 3.3,21.36 4.33,21.36 4.62,21.07 4.62,21.06 7.08,18.6 10.78,18.6 v11.1,18.92
  Bottom 0.2: U$7.B2 1.25,13.1 0.95,13.1 | C11.1 0.95,13.1 | U$5.B2 U$5.A2 13.45,16.6 C7.1 13.38,15.82 13.38,15.72 13.13,15.48 12.77,15.48 12.15,16.1 12.15,18 11.23,18.92 v11.1,18.92 | 0.95,13.1 0.95,12.69 v0.93,12.68
VBATT_IN  (via drill 0.2, 0.2 layers 2-16)
  Top 0.11: 13.47,17.95 SB$1.2
  Top 0.152: U$22.P$1 13.85,16.65 U$22.P$8
  Top 0.2: 13.85,16.65 U$11.P$1 15.04,16.74 v15.07,16.74 | U$13.P$2 v13.5,19.1 13.5,18.2 13.47,18.18 13.47,17.95 13.47,17.82 13.85,17.45 U$22.P$1 | U$12.P$1 3.7,19.4 2.5,20.6 2.5,21.65 v2.9,22.05
  Route15 0.2: v2.9,22.05 3.2,21.75 4.46,21.75 4.9,21.32 5.71,21.32 6.05,20.98 6.05,20.66 7.01,19.7 8.24,19.7 9.37,20.83 9.4,20.83 v9.42,20.85 9.53,20.75 12.24,20.75 12.6,20.39 12.6,20 v13.5,19.1
  Bottom 0.15: v9.42,20.85 9.28,20.85 9.12,20.7 U$6.P$1
  Bottom 0.2: v15.07,16.74 C2.2
VCC  (via drill 0.2)
  Top 0.15: v13.15,12.3 13.5,11.95 R8.1
  Top 0.2: U$1.M15 U$1.L15 5.03,11.73 5.03,11.7 5.27,11.45 6.05,11.45 v6.05,11.3 | v13.15,12.3 13,12.45 12.39,12.45 12.11,12.73 11.74,12.73 11.53,12.51 11.53,12.48 U$1.M2 | v2.1,10.15 2.1,10.85 C16.1 2.15,10.75 U$9.B1
  Route2 0.2: v6.05,11.3 6.05,12.1 | 6.05,12.1 2.5,12.1 2.05,11.65 2.05,10.2 v2.1,10.15 | 6.05,12.1 7.4,12.1 7.6,12.3 v13.15,12.3
VCC_EN  (via drill 0.2)
  Top 0.1: v1.25,9.3 0.95,9.6 U$9.A2
  Bottom 0.1: v1.25,9.3 1.23,9.3 1,9.53 0.56,9.53 0.38,9.71 0.38,17.01 0.52,17.15 1.83,17.15
  Bottom 0.102: U$6.P$29 1.83,17.15
VCC_LPF
  Top 0.15: U$9.B2 0.95,11.25 C12.1 C5.1 | C5.1 1,11.94 | 1,11.94 1.06,12 R1.2 | 1,11.94 C10.1 C5.1
VDD  (via drill 0.2)
  Top 0.1: U$14.P$8 C1.2 | U$10.P$7 3.53,16.43 3.25,16.71 v2.58,16.71
  Top 0.15: C1.2 8.85,17.5 v9.05,17.7
  Top 0.152: C3.2 C9.2
  Top 0.2: C9.2 v13.9,18 | U$10.P$2 2.25,14.05 v2.25,14.25 | C1.2 8.88,17.32 8.91,17.32 9.71,16.52 U$4.A1
  Route2 0.3: v9.05,17.7 8.9,17.7 8.9,20.7 | U$8.P$2 8.9,21.23 8.9,20.7 | 8.9,20.7
  Route15 0.3: v2.58,16.71 2.69,16.6 3.55,16.6 3.55,15.79 | 3.55,15.79 3.55,15.59 2.25,14.29 v2.25,14.25 | v13.9,18 12.29,18 12.2,18.1 9.45,18.1 v9.05,17.7 8.62,17.28 8.62,15.99 8.38,15.75 3.59,15.75 3.55,15.79
  Bottom 0.1: 1.58,21.68 C24.2 | R2.1 10.28,21.77 10.28,20.1 10.47,19.9 10.82,19.9 | 14.55,19.69 R10.1 | R5.1 14.18,21.78 14.55,21.78 14.92,21.4 14.92,20.06 14.55,19.69 | 14.55,19.69 14.55,19.65
  Bottom 0.15: U$6.P$7 v9.05,17.7 | U$6.P$48 8.05,21.65 8.1,21.7 8.85,21.7 | U$20.P$8 10.85,19.88 10.82,19.9 | 8.85,21.7 9.2,21.7 9.39,21.89 R2.1 11.63,21.89 U$20.P$12 | 8.85,21.7 C25.2 | U$6.P$36 1.83,21 1.6,21.23 1.6,21.65 1.58,21.68
  Bottom 0.2: C23.2 U$6.P$24 2.55,14.33 2.48,14.25 v2.25,14.25 | v9.05,17.7 9.25,17.7 9.45,17.5 9.45,16.7 U$6.P$9 | U$6.P$7 8.3,17.7 8.05,17.95 8.05,20.03 7.67,20.41 3.2,20.41 2.93,20.68 2.15,20.68 1.83,21 | U$5.B1 13,17.16 13.83,18 v13.9,18 13.9,18.35 | U$6.P$48 8.05,22.09 U$8.P$2 | 14.01,19.57 14.08,19.65 14.55,19.65 | U$20.P$5 12.8,19.57 14.01,19.57 | 13.9,18.35 13.9,18.9 13.92,18.92 13.92,19.49 14.01,19.57 | 13.9,18.35 13.75,18.35 C6.1
VEE
  Bottom 0.2: U$3.P$4 8.8,12.35 8.2,11.75 3.9,11.75 3.32,12.33 3.05,12.33 | 1.88,12.33 3.05,12.33 | C8.1 3.05,12.33 | U$7.B1 1.88,13.07 1.88,12.33 | C14.2 1.88,12.18 1.88,12.33
VEE_EN
  Bottom 0.1: U$6.P$25 1.48,15.2 1.1,14.83 1.1,13.85 U$7.A2
VESD  (via drill 0.2 layers 1-2)
  Top 0.102: v10.22,11.35 10.47,11.35 10.49,11.38 10.93,11.38 U$1.L2
  Top 0.15: v12.99,11.45 R14.2 13.49,11.41 R8.2
  Route2 0.15: v12.99,11.45 10.32,11.45 v10.22,11.35
VTEST  (via drill 0.2)
  Top 0.1: U$1.K17 3.27,11.35 3.27,10.01 1.81,8.55 v0.62,8.55
  Top 0.102: R_TEST.1 2.9,11.35 U$1.K17
  Route15 0.1: v0.62,8.55 1.22,8.55 1.7,9.03 1.7,12.45 4.18,14.93 v5.07,14.93
  Bottom 0.1: U$6.P$19 5.05,14.9 v5.07,14.93